# EAGLE design bottomboard (EAGLE 7.1.0)
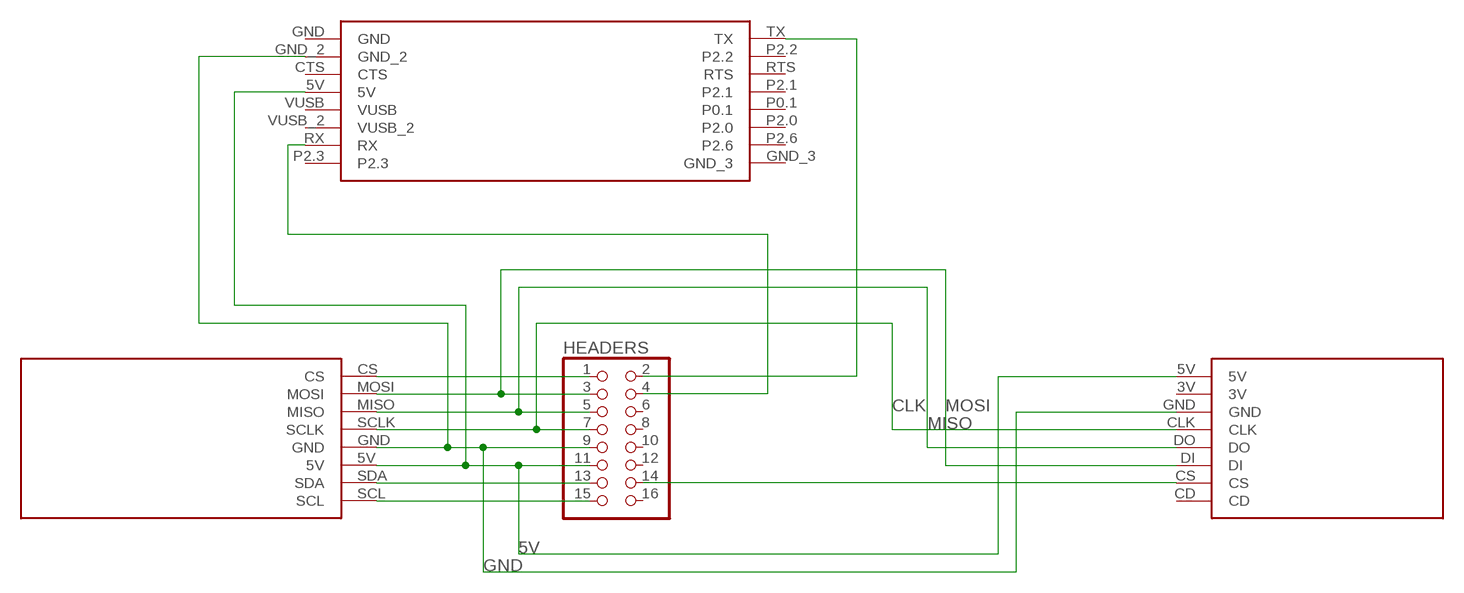
[diagram p0: schematic, sheet 1]

## Parts
HEADERS  PINHD-2X8  [2X08]
U$1  COMMS  [COMMS]
U$2  SDCARD  [SDCARD]
U$3  ARDUCAM  [ARDUCAM]

## Nets
5V: HEADERS.11 U$1.5V U$2.5V U$3.5V
CLK: HEADERS.7 U$2.CLK U$3.SCLK
GND: HEADERS.9 U$1.GND_2 U$2.GND U$3.GND
MISO: HEADERS.5 U$2.DO U$3.MISO
MOSI: HEADERS.3 U$2.DI U$3.MOSI
N$1: HEADERS.1 U$3.CS
N$2: HEADERS.14 U$2.CS
N$3: HEADERS.2 U$1.TX
N$6: HEADERS.4 U$1.RX
N$7: HEADERS.13 U$3.SDA
N$8: HEADERS.15 U$3.SCL
Unconnected: HEADERS.6 HEADERS.8 HEADERS.10 HEADERS.12 HEADERS.16 U$1.CTS U$1.GND U$1.GND_3 U$1.P0.1 U$1.P2.0 U$1.P2.1 U$1.P2.2 U$1.P2.3 U$1.P2.6 U$1.RTS U$1.VUSB U$1.VUSB_2 U$2.3V U$2.CD

## Library data of the parts
HEADERS = pinhead:PINHD-2X8: PIN HEADER
U$1 = comms:COMMS
U$2 = sdcard:SDCARD
U$3 = arducam:ARDUCAM

## Board
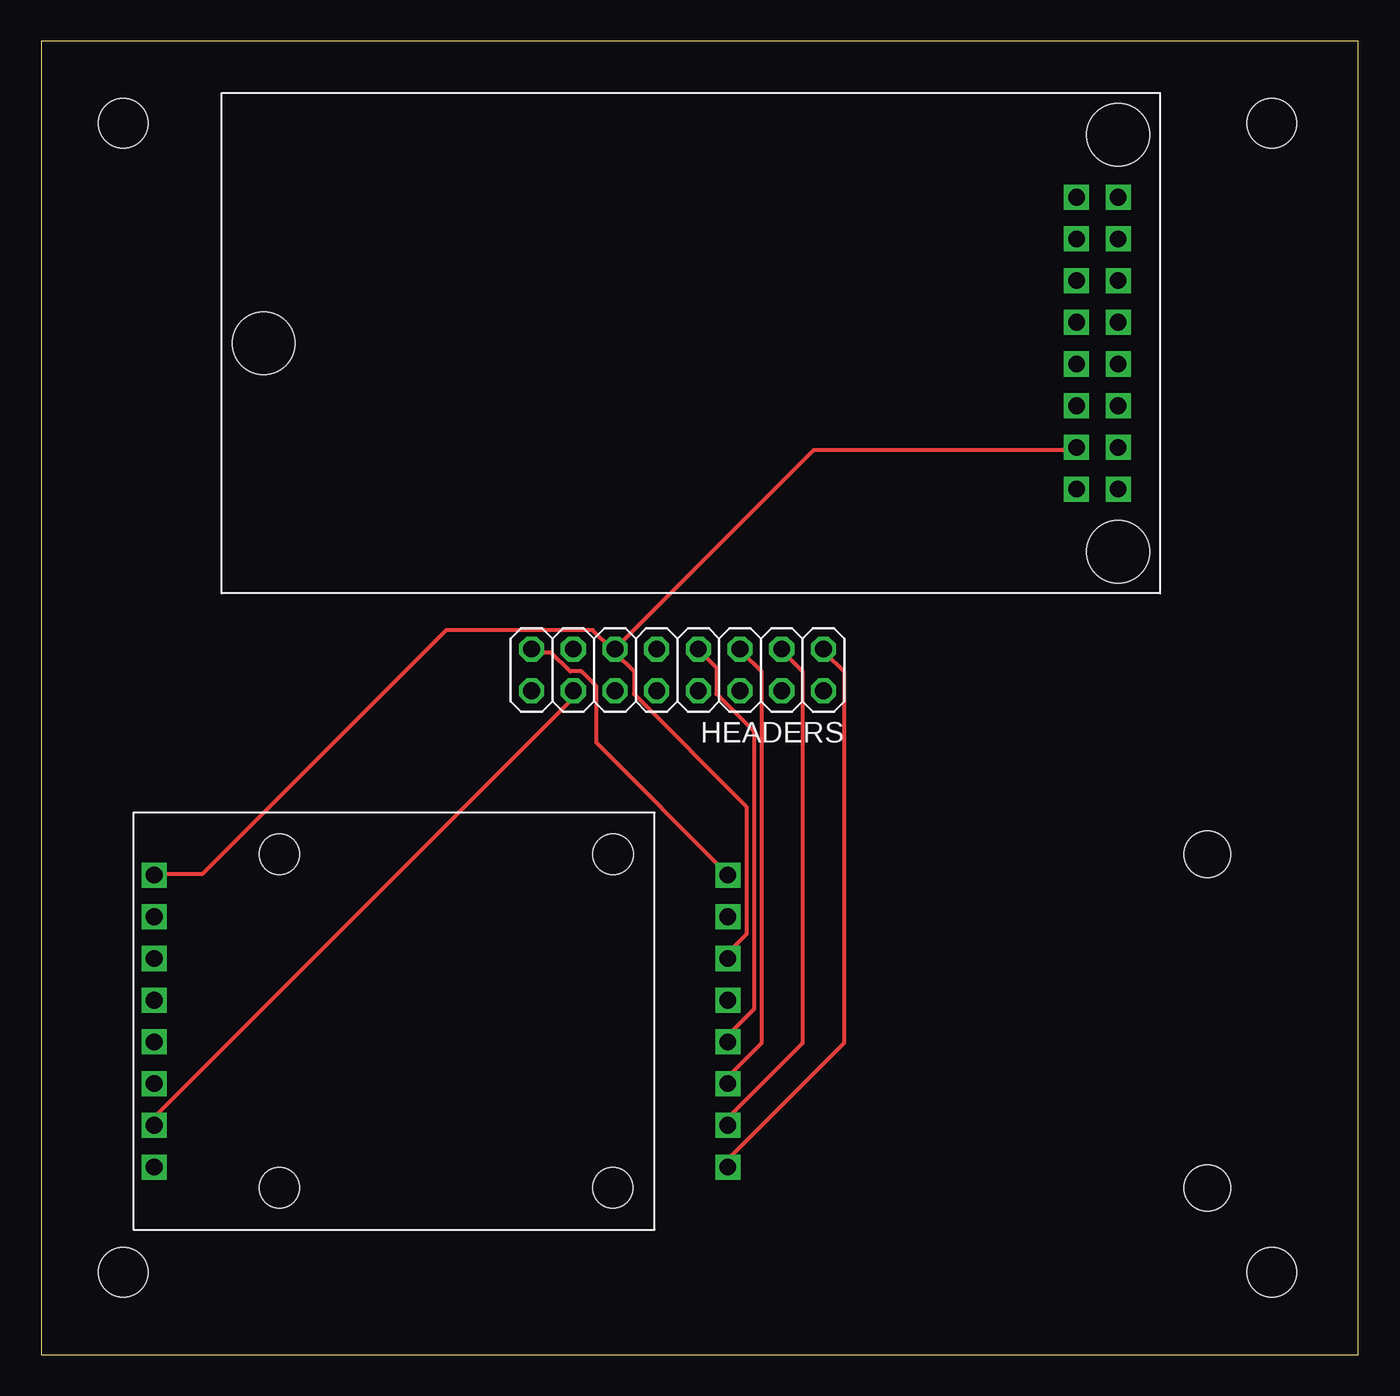
[diagram p1: board, top side]
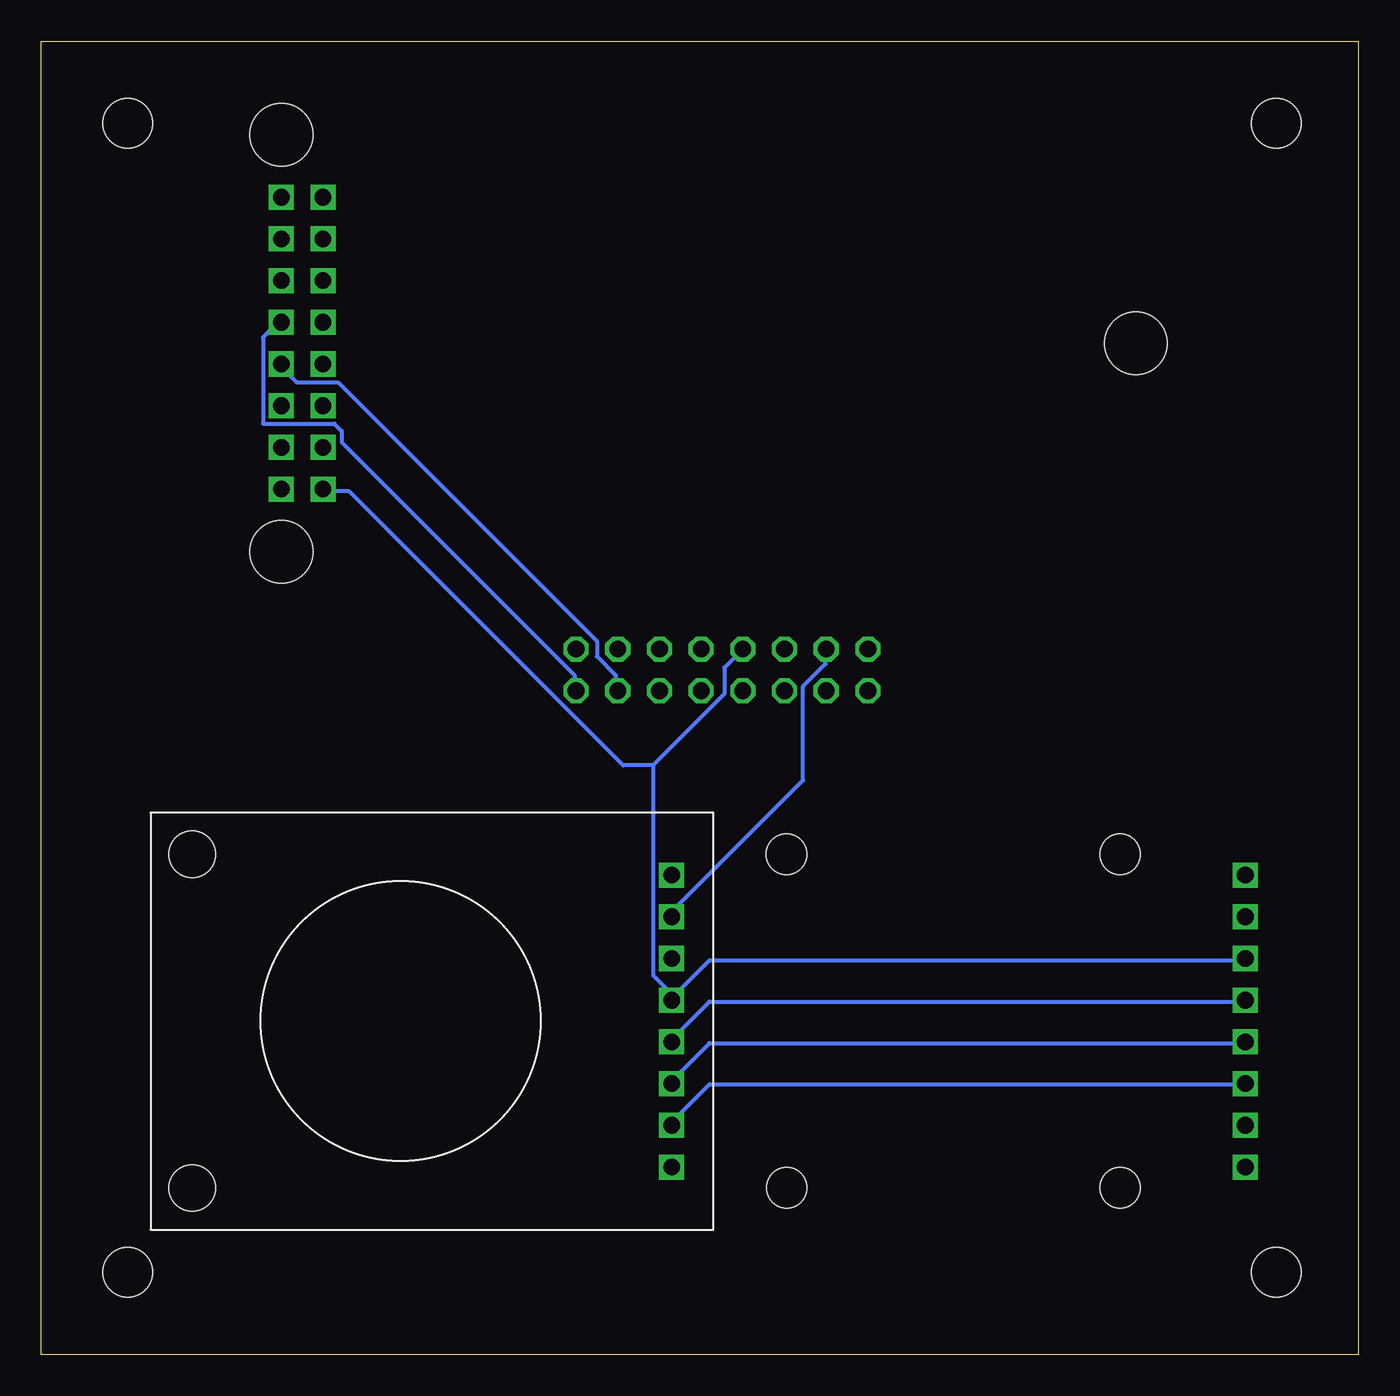
[diagram p2: board, bottom side, seen from below]

Size 80.27 x 80 mm. Coordinates in mm from the lower left corner, seen from the top.
Outline: 0,0 80.27,0 80.27,80 0,80 0,0
Copper layers (1*16): Top 0.035mm / dielectric 1.5mm / Bottom 0.035mm
Design rules "default": minimum track width 10mil, minimum drill 24mil, track to track 8mil, track to pad 8mil, pad to pad 8mil, via to via 8mil, smd to smd 8mil, copper to edge 40mil, drill to drill 8mil, minimum pad ring 10mil, minimum via ring 8mil, stop-mask expansion 4mil, vias tented up to drill 0mil, thermal gap 10mil
Holes 3 mm at 5,75 75,75 75,5 5,5

### Footprints (pad centres in the part's own frame; a part is rotated, then mirrored left to right if it is on the bottom)
2X08 = drill 1.016 octagon: 1 -8.89,-1.27; 2 -8.89,1.27; 3 -6.35,-1.27; 4 -6.35,1.27; 5 -3.81,-1.27; 6 -3.81,1.27; 7 -1.27,-1.27; 8 -1.27,1.27; 9 1.27,-1.27; 10 1.27,1.27; 11 3.81,-1.27; 12 3.81,1.27; 13 6.35,-1.27; 14 6.35,1.27; 15 8.89,-1.27; 16 8.89,1.27
COMMS = drill 1.016 square: 5V -5.08,0; CTS -7.62,0; GND -7.62,2.54; GND_2 -5.08,2.54; GND_3 -5.08,-15.24; P0.1 -7.62,-12.7; P2.0 -5.08,-12.7; P2.1 -5.08,-10.16; P2.2 -5.08,-7.62; P2.3 -5.08,-5.08; P2.6 -7.62,-15.24; RTS -7.62,-10.16; RX -7.62,-5.08; TX -7.62,-7.62; VUSB -7.62,-2.54; VUSB_2 -5.08,-2.54 | hole 3.81: -7.62,6.35; -7.62,-19.05; 44.45,-6.35
SDCARD = drill 1.016 square: 3V 30.48,6.35; 5V 30.48,3.81; CD 30.48,21.59; CLK 30.48,11.43; CS 30.48,19.05; DI 30.48,16.51; DO 30.48,13.97; GND 30.48,8.89 | hole 2.449: 2.54,22.86; 22.86,2.54; 22.86,22.86 | hole 2.46: 2.54,2.54
ARDUCAM = drill 1.016 square: 5V 2.54,7.62; CS 2.54,20.32; GND 2.54,10.16; MISO 2.54,15.24; MOSI 2.54,17.78; SCL 2.54,2.54; SCLK 2.54,12.7; SDA 2.54,5.08 | hole 2.8: 31.75,21.59; 31.75,1.27

### Placement (x,y rotation side)
HEADERS  38.78,41.7 180 top
U$1  58.01,55.25 180 top
U$2  37.38,33.01 180 top
U$3  39.31,31.74 180 bottom

### Tracks (layer width: path | path; a pad name or v marks a point on that pad's centre or on a via)
5V
  Top 0.254: U$3.5V 42.06,24.23 42.06,24.69 42.98,25.6 42.98,33.38 36.12,40.23 36.12,41.6 34.98,42.75 HEADERS.11 | U$2.5V 7.09,29.26 9.83,29.26 24.69,44.12 33.6,44.12 34.75,42.98 HEADERS.11 | U$1.5V 62.87,55.09 47.09,55.09 HEADERS.11
CLK
  Top 0.254: U$3.SCLK 42.06,19.2 42.06,19.66 43.43,21.03 43.43,37.95 41.15,40.23 41.15,41.83 40.23,42.75 HEADERS.7
  Bottom 0.254: U$2.CLK 7.09,21.49 39.55,21.49 41.83,19.2 U$3.SCLK
GND
  Bottom 0.254: 42.98,35.89 42.98,23.09 42.06,22.17 42.06,21.72 U$3.GND 41.83,21.72 39.55,24 7.09,24 U$2.GND | 42.98,35.89 38.63,40.23 38.63,41.83 37.72,42.75 HEADERS.9 | 42.98,35.89 44.81,35.89 61.49,52.58 62.87,52.58 U$1.GND_2
MISO
  Top 0.254: U$3.MISO 42.06,16.69 42.06,17.14 43.89,18.97 43.89,41.6 42.75,42.75 HEADERS.5
  Bottom 0.254: U$2.DO 7.09,18.97 39.55,18.97 41.83,16.69 U$3.MISO
MOSI
  Top 0.254: U$3.MOSI 42.06,14.17 42.06,14.63 46.41,18.97 46.41,41.6 45.26,42.75 HEADERS.3
  Bottom 0.254: U$2.DI 7.09,16.46 39.55,16.46 41.83,14.17 U$3.MOSI
N$1
  Top 0.254: U$3.CS 42.06,11.43 42.06,12.12 48.92,18.97 48.92,41.6 47.78,42.75 HEADERS.1
N$2
  Top 0.254: U$2.CS 7.09,14.17 7.09,14.63 32.23,39.78 32.23,40.23 HEADERS.14
N$3
  Bottom 0.254: HEADERS.2 47.78,40.46 47.78,41.38 61.95,55.55 61.95,56.24 62.41,56.69 66.75,56.69 66.75,61.95 65.84,62.87 U$1.TX
N$6
  Bottom 0.254: HEADERS.4 45.26,40.46 45.26,41.38 46.41,42.52 46.41,43.43 62.18,59.21 64.69,59.21 65.61,60.12 U$1.RX
N$7
  Bottom 0.254: HEADERS.13 32.46,42.75 32.46,42.06 33.83,40.69 33.83,34.98 42.06,26.75 U$3.SDA
N$8
  Top 0.254: HEADERS.15 29.95,42.75 31.09,42.75 32.23,41.6 32.92,41.6 33.83,40.69 33.83,37.26 41.83,29.26 U$3.SCL